# EAGLE design schematic-single-motor (EAGLE 6.4)
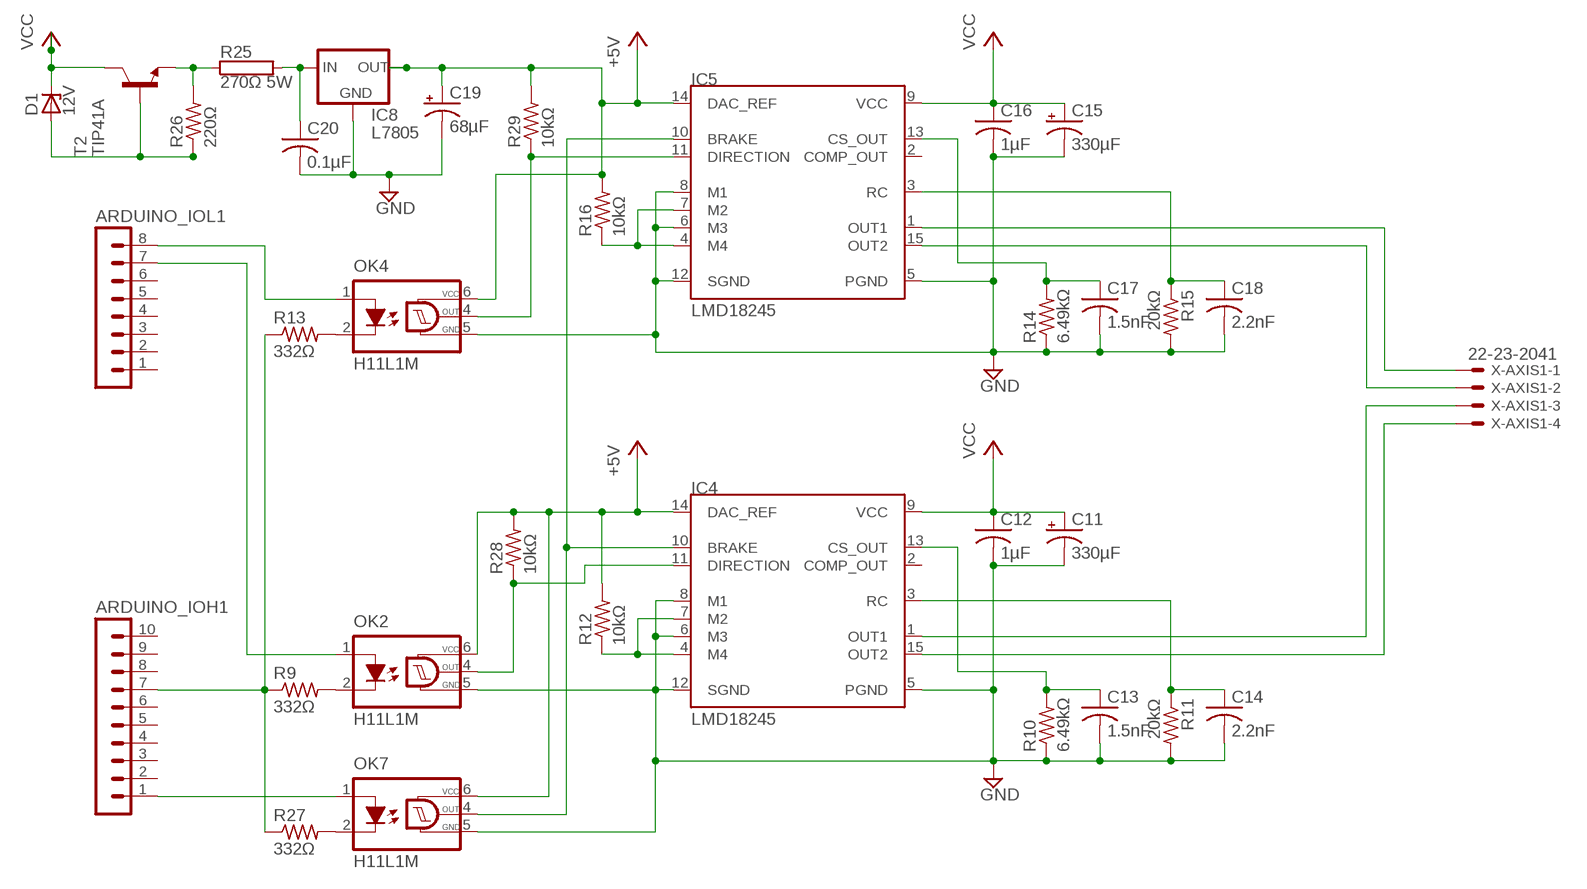
[diagram p0: schematic, sheet 1]

## Parts
ARDUINO_IOH1  MA10-1  [MA10-1]
ARDUINO_IOL1  MA08-1  [MA08-1]
C11  330µF  CPOL-USE5-13  [E5-13]
C12  1µF  C-US050-024X044  [C050-024X044]
C13  1.5nF  C-US050-024X044  [C050-024X044]
C14  2.2nF  C-US050-024X044  [C050-024X044]
C15  330µF  CPOL-USE5-13  [E5-13]
C16  1µF  C-US050-024X044  [C050-024X044]
C17  1.5nF  C-US050-024X044  [C050-024X044]
C18  2.2nF  C-US050-024X044  [C050-024X044]
C19  68µF  CPOL-USE2.5-6  [E2,5-6]
C20  0.1µF  C-US102-054X133  [C102-054X133]
D1  12V  ZPY  [DO41Z10]
IC4  LMD18245  [MULTIWATT-15]
IC5  LMD18245  [MULTIWATT-15]
IC8  L7805  78XXS  [78XXS]
OK2  H11L1M  [DIL06]
OK4  H11L1M  [DIL06]
OK7  H11L1M  [DIL06]
R9  332Ω  R-US_0204/7  [0204/7]
R10  6.49kΩ  R-US_0204/7  [0204/7]
R11  20kΩ  R-US_0204/7  [0204/7]
R12  10kΩ  R-US_0204/7  [0204/7]
R13  332Ω  R-US_0204/7  [0204/7]
R14  6.49kΩ  R-US_0204/7  [0204/7]
R15  20kΩ  R-US_0204/7  [0204/7]
R16  10kΩ  R-US_0204/7  [0204/7]
R25  270Ω 5W  RHPS523  [HPS523]
R26  220Ω  R-US_0204/7  [0204/7]
R27  332Ω  R-US_0204/7  [0204/7]
R28  10kΩ  R-US_0204/7  [0204/7]
R29  10kΩ  R-US_0204/7  [0204/7]
T2  TIP41A  -NPN-TO202V  [TO202V]
X-AXIS1  22-23-2041  [22-23-2041]

## Nets
+5V: C19.+ IC4.14(DAC_REF) IC5.14(DAC_REF) IC8.OUT OK2.6(VCC) OK4.6(VCC) OK7.6(VCC) R12.2 R16.2 R28.2 R29.2
GND: C11.- C12.2 C13.2 C14.2 C15.- C16.2 C17.2 C18.2 C19.- C20.2 IC4.5(PGND) IC4.6(M3) IC4.8(M1) IC4.12(SGND) IC5.5(PGND) IC5.6(M3) IC5.8(M1) IC5.12(SGND) IC8.GND OK2.5(GND) OK4.5(GND) OK7.5(GND) R10.1 R11.2 R14.1 R15.2
N$9: C13.1 IC4.13(CS_OUT) R10.2
N$13: C14.1 IC4.3(RC) R11.1
N$14: IC4.4(M4) IC4.7(M2) R12.1
N$18: IC5.11(DIRECTION) OK4.4(OUT) R29.1
N$19: C17.1 IC5.13(CS_OUT) R14.2
N$23: C18.1 IC5.3(RC) R15.1
N$24: IC5.4(M4) IC5.7(M2) R16.1
N$25: IC5.1(OUT1) X-AXIS1.1
N$26: IC5.15(OUT2) X-AXIS1.2
N$27: IC4.1(OUT1) X-AXIS1.3
N$28: IC4.15(OUT2) X-AXIS1.4
N$29: ARDUINO_IOL1.7 OK2.1(A)
N$30: ARDUINO_IOH1.7 R9.1 R13.1 R27.1
N$31: OK2.2(C) R9.2
N$32: OK4.2(C) R13.2
N$33: ARDUINO_IOL1.8 OK4.1(A)
N$42: D1.A R26.1 T2.3(B)
N$48: R25.1 R26.2 T2.1(E)
N$52: C20.1 IC8.IN R25.2
N$53: OK7.2(C) R27.2
N$54: ARDUINO_IOH1.1 OK7.1(A)
N$55: IC4.10(BRAKE) IC5.10(BRAKE) OK7.4(OUT)
N$56: IC4.11(DIRECTION) OK2.4(OUT) R28.1
VCC: C11.+ C12.1 C15.+ C16.1 D1.C IC4.9(VCC) IC5.9(VCC) T2.2(C)
Unconnected: ARDUINO_IOH1.2 ARDUINO_IOH1.3 ARDUINO_IOH1.4 ARDUINO_IOH1.5 ARDUINO_IOH1.6 ARDUINO_IOH1.8 ARDUINO_IOH1.9 ARDUINO_IOH1.10 ARDUINO_IOL1.1 ARDUINO_IOL1.2 ARDUINO_IOL1.3 ARDUINO_IOL1.4 ARDUINO_IOL1.5 ARDUINO_IOL1.6 IC4.2(COMP_OUT) IC5.2(COMP_OUT)

## Library data of the parts
ARDUINO_IOH1 = con-lstb:MA10-1: PIN HEADER; OC_FARNELL: unknown; OC_NEWARK: unknown
ARDUINO_IOL1 = con-lstb:MA08-1: PIN HEADER; OC_FARNELL: unknown; OC_NEWARK: unknown
C11 C15 C19 = resistor:CPOL-US: POLARIZED CAPACITOR, American symbol
C12-C14 C16-C18 C20 = resistor:C-US: CAPACITOR, American symbol
D1 = diode:ZPY: Z DIODE 1 W
IC4 IC5 = eagleLibrary:LMD18245: LMD18245 3A, 55V DMOS Full-Bridge Motor Driver; MF: Texas Instruments; MPN: LMD18245; OC_FARNELL: 1589425; OC_NEWARK: 32M1527
IC8 = v-reg:78XXS: VOLTAGE REGULATOR
OK2 OK4 OK7 = optocoupler:H11L*M: 6-Pin DIP Optocoupler Source: http://www.fairchildsemi.com/ds/H1/H11L2-M.pdf; MF: FAIRCHILD SEMICONDUCTOR; MPN: H11L1-M; OC_FARNELL: 1021127; OC_NEWARK: 72K8643
R9-R16 R26-R29 = resistor:R-US_: RESISTOR, American symbol
R25 = resistor-power:R: Power Resitor; OC_FARNELL: unknown; OC_NEWARK: unknown
T2 = transistor:*-NPN-: NPN Transistror BF959 corrected 2008.03.06
X-AXIS1 = con-molex:22-23-2041: .100" (2.54mm) Center Header - 4 Pin; MF: MOLEX; MPN: 22-23-2041; OC_FARNELL: 1462920; OC_NEWARK: 38C0355

## Board
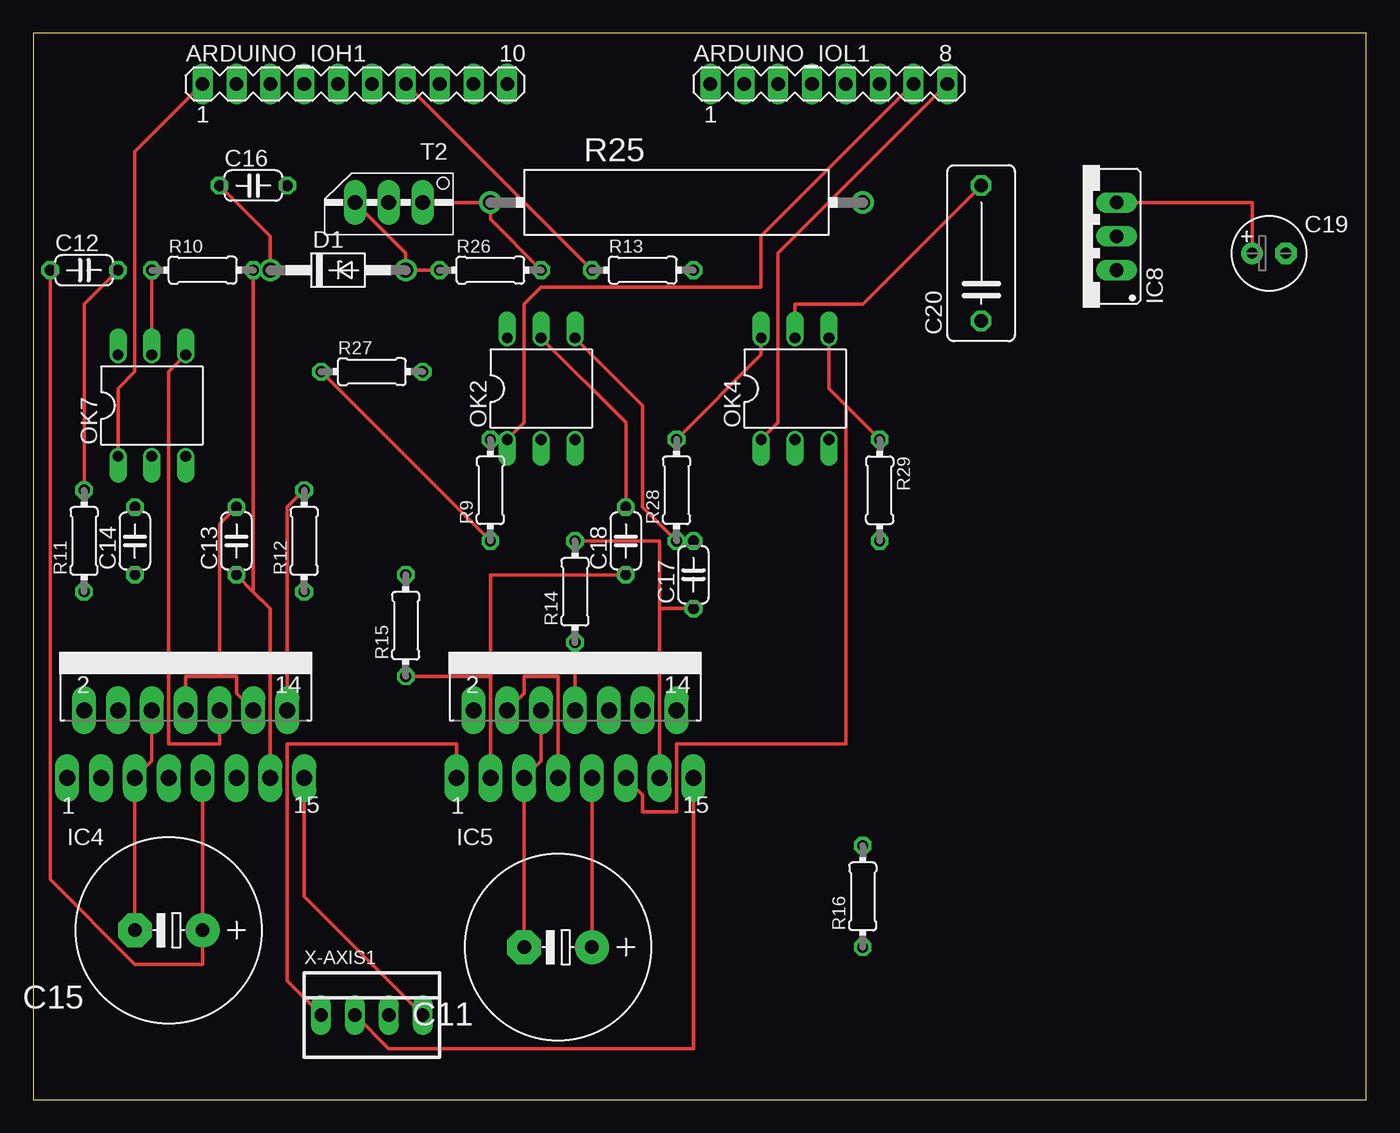
[diagram p1: board, top side]
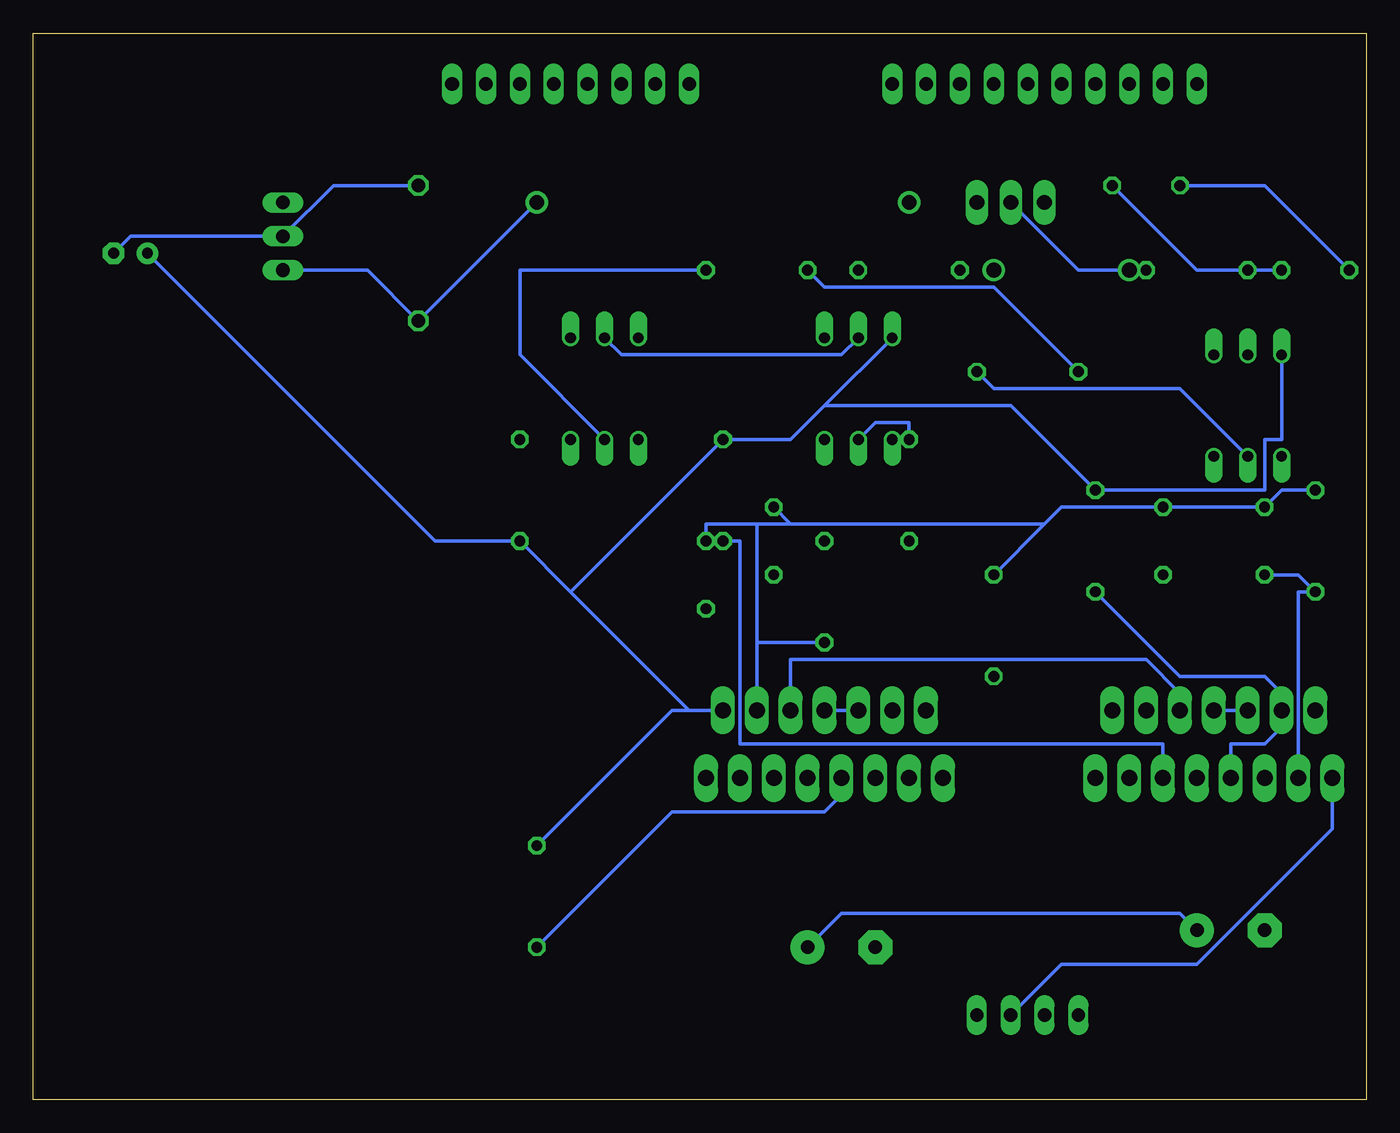
[diagram p2: board, bottom side, seen from below]

Size 100 x 80 mm. Coordinates in mm from the lower left corner, seen from the top.
Outline: 0,0 100,0 100,80 0,80 0,0
Copper layers (1*16): Top 0.035mm / dielectric 1.5mm / Bottom 0.035mm
Design rules "default": minimum track width 10mil, minimum drill 24mil, track to track 8mil, track to pad 8mil, pad to pad 8mil, via to via 8mil, smd to smd 8mil, copper to edge 40mil, drill to drill 8mil, minimum pad ring 10mil, minimum via ring 8mil, stop-mask expansion 4mil, vias tented up to drill 0mil, thermal gap 10mil

### Footprints (pad centres in the part's own frame; a part is rotated, then mirrored left to right if it is on the bottom)
MA10-1 = drill 1.016 long: 1 -11.43,0; 2 -8.89,0; 3 -6.35,0; 4 -3.81,0; 5 -1.27,0; 6 1.27,0; 7 3.81,0; 8 6.35,0; 9 8.89,0; 10 11.43,0
MA08-1 = drill 1.016 long: 1 -8.89,0; 2 -6.35,0; 3 -3.81,0; 4 -1.27,0; 5 1.27,0; 6 3.81,0; 7 6.35,0; 8 8.89,0
E5-13 = drill 1.016 pad 2.54: + -2.54,0 | drill 1.016 pad 2.54 octagon: - 2.54,0
C050-024X044 = drill 0.813 octagon: 1 -2.54,0; 2 2.54,0
E2,5-6 = drill 0.813 pad 1.6: + -1.27,0 | drill 0.813 pad 1.6 octagon: - 1.27,0
C102-054X133 = drill 1.016 octagon: 1 -5.08,0; 2 5.08,0
DO41Z10 = drill 1.118: A 5.08,0; C -5.08,0
MULTIWATT-15 = drill 1.2 long: 1 -8.89,-7.62; 2 -7.62,-2.54; 3 -6.35,-7.62; 4 -5.08,-2.54; 5 -3.81,-7.62; 6 -2.54,-2.54; 7 -1.27,-7.62; 8 0,-2.54; 9 1.27,-7.62; 10 2.54,-2.54; 11 3.81,-7.62; 12 5.08,-2.54; 13 6.35,-7.62; 14 7.62,-2.54; 15 8.89,-7.62
78XXS = drill 1.016 long: GND 0,-2.54; IN -2.54,-2.54; OUT 2.54,-2.54
DIL06 = drill 0.813 offset: 1 -2.54,-3.81; 2 0,-3.81; 3 2.54,-3.81; 4 2.54,3.81; 5 0,3.81; 6 -2.54,3.81
0204/7 = drill 0.813 octagon: 1 -3.81,0; 2 3.81,0
HPS523 = drill 1.1 pad 1.7: 1 -13.97,0; 2 13.97,0
TO202V = drill 1.118 long: 1 -2.54,-2.54; 2 0,-2.54; 3 2.54,-2.54
22-23-2041 = drill 1 long: 1 -3.81,0; 2 -1.27,0; 3 1.27,0; 4 3.81,0

### Placement (x,y rotation side)
ARDUINO_IOH1  24.13,76.2 0 top
ARDUINO_IOL1  59.69,76.2 0 top
C11  39.37,11.43 180 top
C12  3.81,62.23 0 top
C13  15.24,41.91 90 top
C14  7.62,41.91 90 top
C15  10.16,12.7 180 top
C16  16.51,68.58 0 top
C17  49.53,39.37 90 top
C18  44.45,41.91 90 top
C19  92.71,63.5 0 top
C20  71.12,63.5 90 top
D1  22.86,62.23 0 top
IC4  11.43,31.75 0 top
IC5  40.64,31.75 0 top
IC8  78.74,64.77 90 top
OK2  38.1,53.34 0 top
OK4  57.15,53.34 0 top
OK7  8.89,52.07 0 top
R9  34.29,45.72 90 top
R10  12.7,62.23 0 top
R11  3.81,41.91 90 top
R12  20.32,41.91 90 top
R13  45.72,62.23 0 top
R14  40.64,38.1 90 top
R15  27.94,35.56 90 top
R16  62.23,15.24 90 top
R25  48.26,67.31 0 top
R26  34.29,62.23 0 top
R27  25.4,54.61 0 top
R28  48.26,45.72 90 top
R29  63.5,45.72 270 top
T2  26.67,64.77 180 top
X-AXIS1  25.4,6.35 0 top

### Tracks (layer width: path | path; a pad name or v marks a point on that pad's centre or on a via)
+5V
  Top 0.254: R12.2 19.05,44.45 IC4.14 | R28.2 54.61,55.88 OK4.6 | IC8.OUT 91.44,67.31 C19.+
  Bottom 0.254: OK7.6 6.35,49.53 7.62,49.53 7.62,45.72 R12.2 26.67,52.07 40.64,52.07 | 40.64,52.07 43.18,49.53 R28.2 59.69,38.1 | 40.64,52.07 OK2.6 | R16.2 52.07,29.21 50.8,29.21 | IC5.14 50.8,29.21 | 50.8,29.21 59.69,38.1 | 59.69,38.1 R29.2 69.85,41.91 C19.+
GND
  Top 0.254: IC5.8 R14.1 | IC5.6 38.1,25.4 IC5.5 C11.- | IC4.6 8.89,25.4 IC4.5 C15.- | IC4.12 15.24,30.48 15.24,31.75 13.97,31.75 | 13.97,31.75 11.43,31.75 IC4.8 | R10.1 OK7.5 | OK2.5 44.45,50.8 C18.2 | C12.2 3.81,59.69 R11.2 | C20.2 62.23,59.69 57.15,59.69 OK4.5 | 13.97,31.75 13.97,43.18 C13.2
  Bottom 0.254: 45.72,34.29 IC5.12 | R14.1 45.72,34.29 | IC5.6 IC5.8 | IC4.6 IC4.8 | C20.2 77.47,68.58 IC8.GND 92.71,64.77 C19.- | C12.2 R10.1 12.7,62.23 C16.2 | R11.2 6.35,45.72 C14.2 C13.2 22.86,44.45 24.13,43.18 | 24.13,43.18 R15.2 | 43.18,43.18 C18.2 | 24.13,43.18 43.18,43.18 | C17.2 49.53,43.18 45.72,43.18 | 43.18,43.18 45.72,43.18 | OK4.5 55.88,55.88 39.37,55.88 OK2.5 | 45.72,43.18 45.72,34.29
N$9
  Top 0.254: 16.51,38.1 17.78,36.83 IC4.13 | 16.51,38.1 C13.1 | 16.51,38.1 R10.2
N$13
  Bottom 0.254: C14.1 5.08,39.37 R11.1 5.08,38.1 IC4.3
N$14
  Bottom 0.254: R12.1 13.97,31.75 7.62,31.75 6.35,30.48 IC4.4 6.35,27.94 7.62,26.67 10.16,26.67 IC4.7
N$18
  Top 0.254: 60.96,52.07 59.69,53.34 OK4.4 | 60.96,52.07 R29.1 | IC5.11 45.72,22.86 45.72,21.59 48.26,21.59 48.26,26.67 60.96,26.67 60.96,52.07
N$19
  Top 0.254: R14.2 46.99,41.91 46.99,36.83 | IC5.13 46.99,36.83 | 46.99,36.83 C17.1
N$23
  Top 0.254: 34.29,31.75 R15.1 | IC5.3 34.29,31.75 | C18.1 34.29,39.37 34.29,31.75
N$24
  Top 0.254: IC5.4 36.83,30.48 36.83,31.75 39.37,31.75 IC5.7
  Bottom 0.254: R16.1 52.07,21.59 40.64,21.59 39.37,22.86 IC5.7
N$25
  Top 0.254: X-AXIS1.1 19.05,8.89 19.05,26.67 31.75,26.67 IC5.1
N$26
  Top 0.254: X-AXIS1.2 26.67,3.81 49.53,3.81 IC5.15
N$27
  Bottom 0.254: X-AXIS1.3 22.86,10.16 12.7,10.16 2.54,20.32 IC4.1
N$28
  Top 0.254: X-AXIS1.4 20.32,15.24 IC4.15
N$29
  Top 0.254: OK2.1 36.83,50.8 36.83,59.69 38.1,60.96 54.61,60.96 54.61,64.77 ARDUINO_IOL1.7
N$30
  Top 0.254: R27.1 R9.1 | ARDUINO_IOH1.7 R13.1
  Bottom 0.254: R27.1 27.94,60.96 40.64,60.96 R13.1
N$31
  Bottom 0.254: R9.2 34.29,50.8 36.83,50.8 OK2.2
N$32
  Bottom 0.254: OK4.2 63.5,55.88 63.5,62.23 R13.2
N$33
  Top 0.254: OK4.1 55.88,50.8 55.88,63.5 ARDUINO_IOL1.8
N$42
  Top 0.254: R26.1 D1.A 27.94,63.5 T2.3
N$48
  Top 0.254: R26.2 34.29,66.04 R25.1 T2.1
N$52
  Bottom 0.254: IC8.IN 74.93,62.23 C20.1 R25.2
N$53
  Bottom 0.254: OK7.2 13.97,53.34 27.94,53.34 R27.2
N$54
  Top 0.254: OK7.1 6.35,53.34 7.62,54.61 7.62,71.12 ARDUINO_IOH1.1
N$55
  Top 0.254: OK7.4 10.16,54.61 10.16,26.67 13.97,26.67 IC4.10
  Bottom 0.254: IC5.10 43.18,33.02 16.51,33.02 13.97,30.48 IC4.10
N$56
  Top 0.254: R28.1 45.72,44.45 45.72,52.07 OK2.4
  Bottom 0.254: IC4.11 15.24,26.67 46.99,26.67 46.99,41.91 R28.1
VCC
  Top 0.254: D1.C 17.78,64.77 C16.1 | IC4.9 C15.+ 12.7,10.16 7.62,10.16 1.27,16.51 C12.1 | C11.+ IC5.9
  Bottom 0.254: C12.1 7.62,68.58 C16.1 | T2.2 21.59,62.23 D1.C | C15.+ 13.97,13.97 39.37,13.97 C11.+